# EAGLE design Smart_switch_edge_AI_V2 (EAGLE 9.6.2)
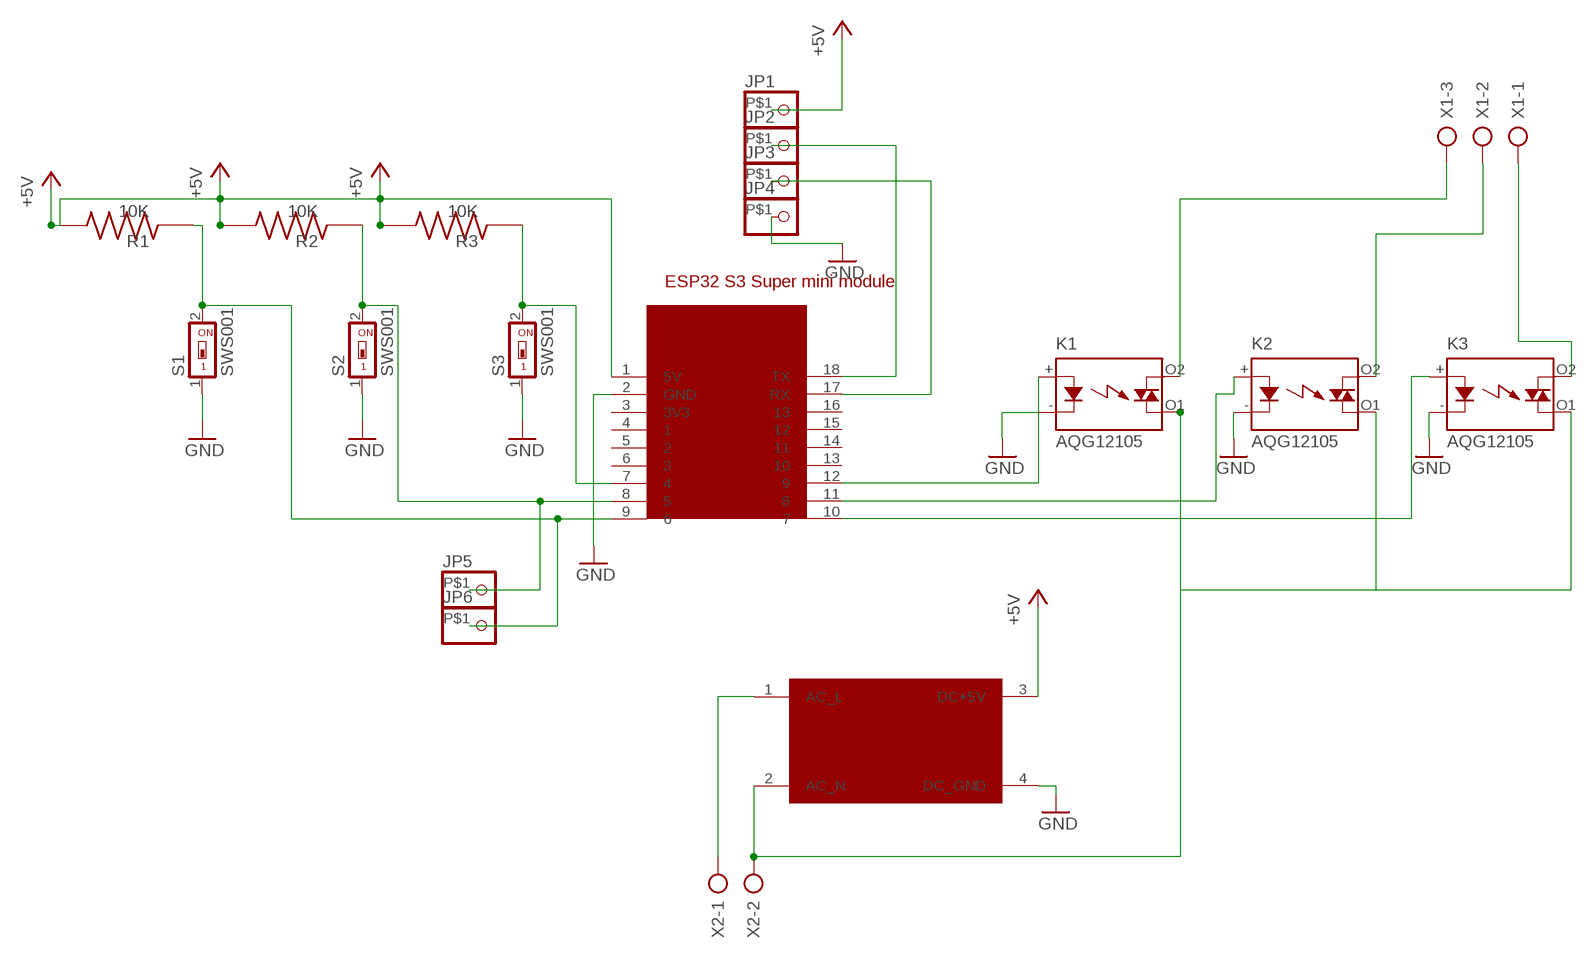
[diagram p0: schematic, sheet 1]

## Parts
JP1  PINHD-1X1-BIGPOGO  [1X1-BIGPOGO]
JP2  PINHD-1X1-BIGPOGO  [1X1-BIGPOGO]
JP3  PINHD-1X1-BIGPOGO  [1X1-BIGPOGO]
JP4  PINHD-1X1-BIGPOGO  [1X1-BIGPOGO]
JP5  PINHD-1X1-BIGPOGO  [1X1-BIGPOGO]
JP6  PINHD-1X1-BIGPOGO  [1X1-BIGPOGO]
K1  AQG12105  [AQG]
K2  AQG12105  [AQG]
K3  AQG12105  [AQG]
R1  10K  ERA6ARB512V  [RES_ERA6ARB512V]
R2  10K  ERA6ARB512V  [RES_ERA6ARB512V]
R3  10K  ERA6ARB512V  [RES_ERA6ARB512V]
S1  SWS001  [SMS-001]
S2  SWS001  [SMS-001]
S3  SWS001  [SMS-001]
U$1  ESP32_S3_SUPERMINI  [SON270P1795X2385X160-18N]
U$2  AL0505F  [DIP1650W60P600L1447H300Q4B]
X1  AK500/3  [AK500/3]
X2  AK500/2  [AK500/2]

## Nets
+5V: JP1.P$1 R1.2 R2.2 R3.2 U$1.1(5V) U$2.3(DC+5V)
GND: JP4.P$1 K1.-(K) K2.-(K) K3.-(K) S1.1 S2.1 S3.1 U$1.2(GND) U$2.4(DC_GND)
N$1: JP6.P$1 R1.1 S1.2 U$1.9
N$2: JP5.P$1 R2.1 S2.2 U$1.8
N$3: R3.1 S3.2 U$1.7
N$4: K1.+(A) U$1.12
N$5: K2.+(A) U$1.11
N$6: K3.+(A) U$1.10
N$7: K1.O2(DS1) X1.3
N$8: K2.O2(DS1) X1.2
N$9: K3.O2(DS1) X1.1
N$10: K1.O1(DS2) K2.O1(DS2) K3.O1(DS2) U$2.2(AC_N) X2.2
N$11: U$2.1(AC_L) X2.1
N$12: JP2.P$1 U$1.18(TX)
N$13: JP3.P$1 U$1.17(RX)
Unconnected: U$1.3(3V3) U$1.4 U$1.5 U$1.6 U$1.13 U$1.14 U$1.15 U$1.16

## Library data of the parts
JP1-JP6 = adafruit:PINHD-1X1: Pin header 1x1 for 0.1" spacing With round pins
K1-K3 = relay:AQG*: SOLID STATE RELAY NAiS Zero-cross, Non zero-cross Source: http://www.mew-europe.com/.. en_ds_61611_0000.pdf; MF: AROMAT/ MATSUSHITA; MPN: AQG12105; OC_FARNELL: unknown; OC_NEWARK: 20J4759
R1-R3 = ERA6ARB512V:ERA6ARB512V: Check availability <https://pricing.snapeda.com/parts/ERA-6ARB512V/Panasonic/view-part?ref=eda>; AVAILABILITY: In Stock; CHECK_PRICES: https://www.snapeda.com/parts/ERA-6ARB512V/Panasonic/view-part/?ref=eda; DESCRIPTION: RES 5.1K OHM 0.1% 1/8W 0805; MF: Panasonic; MP: ERA-6ARB512V; PACKAGE: 2012-2 Panasonic; PRICE: None; SNAPEDA_LINK: https://www.snapeda.com/parts/ERA-6ARB512V/Panasonic/view-part/?ref=snap
S1-S3 = smd-special:SWS001: SMD Dip Switch 1 pol.
U$1 = ESP32_S3_super_mini:ESP32_S3_SUPERMINI: ESP32_S3_supermini
U$2 = AL0505F:AL0505F: AL0505F AC to DC 5 volt 5W module
X1 = con-ptr500:AK500/3: CONNECTOR; OC_FARNELL: unknown; OC_NEWARK: unknown
X2 = con-ptr500:AK500/2: CONNECTOR; OC_FARNELL: unknown; OC_NEWARK: unknown

## Board
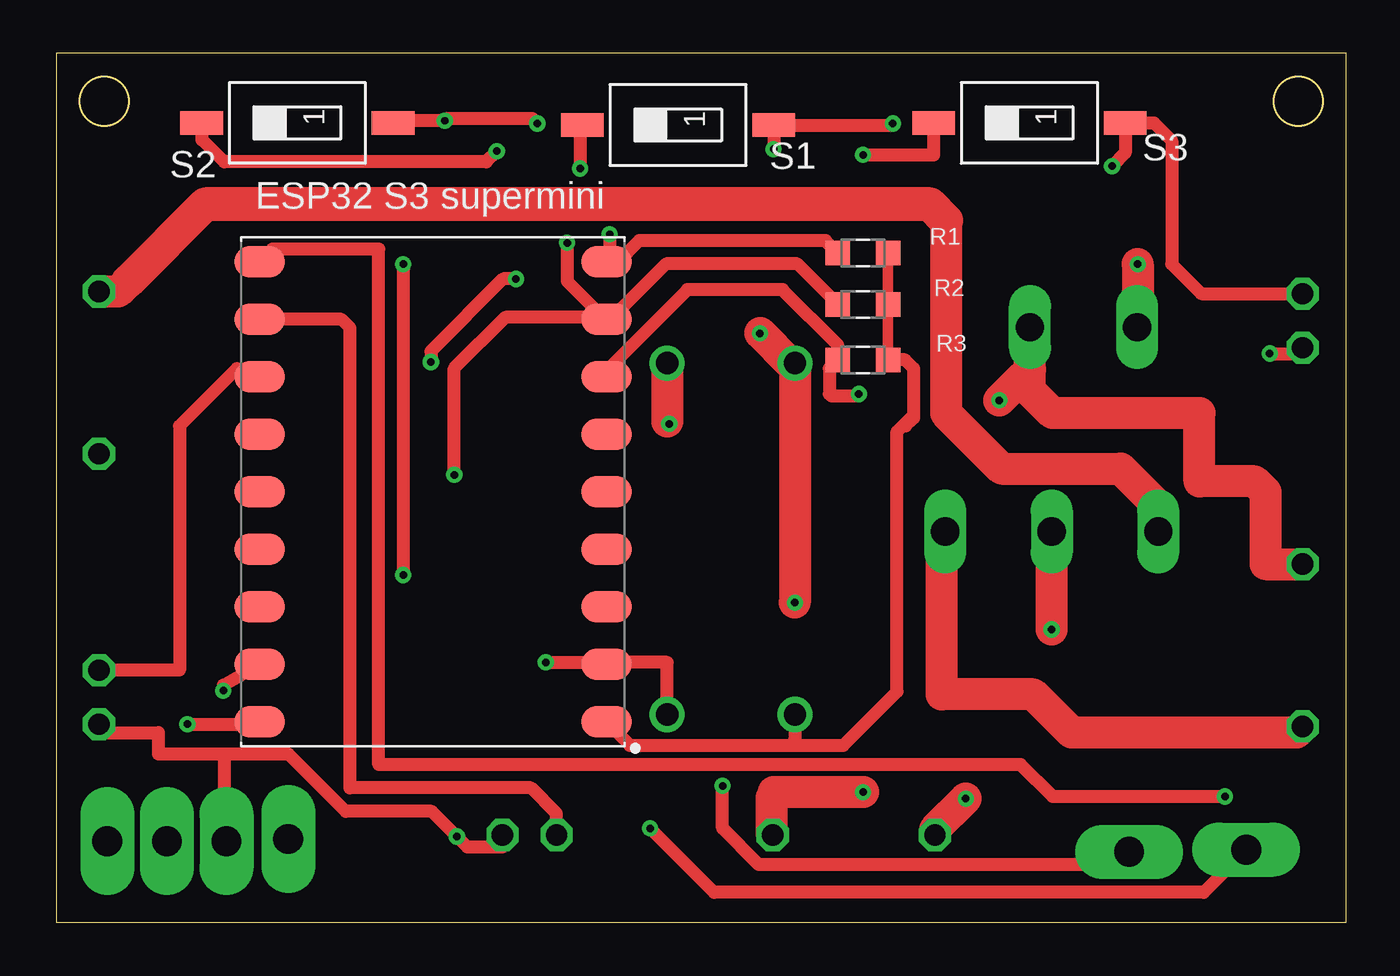
[diagram p1: board, top side]
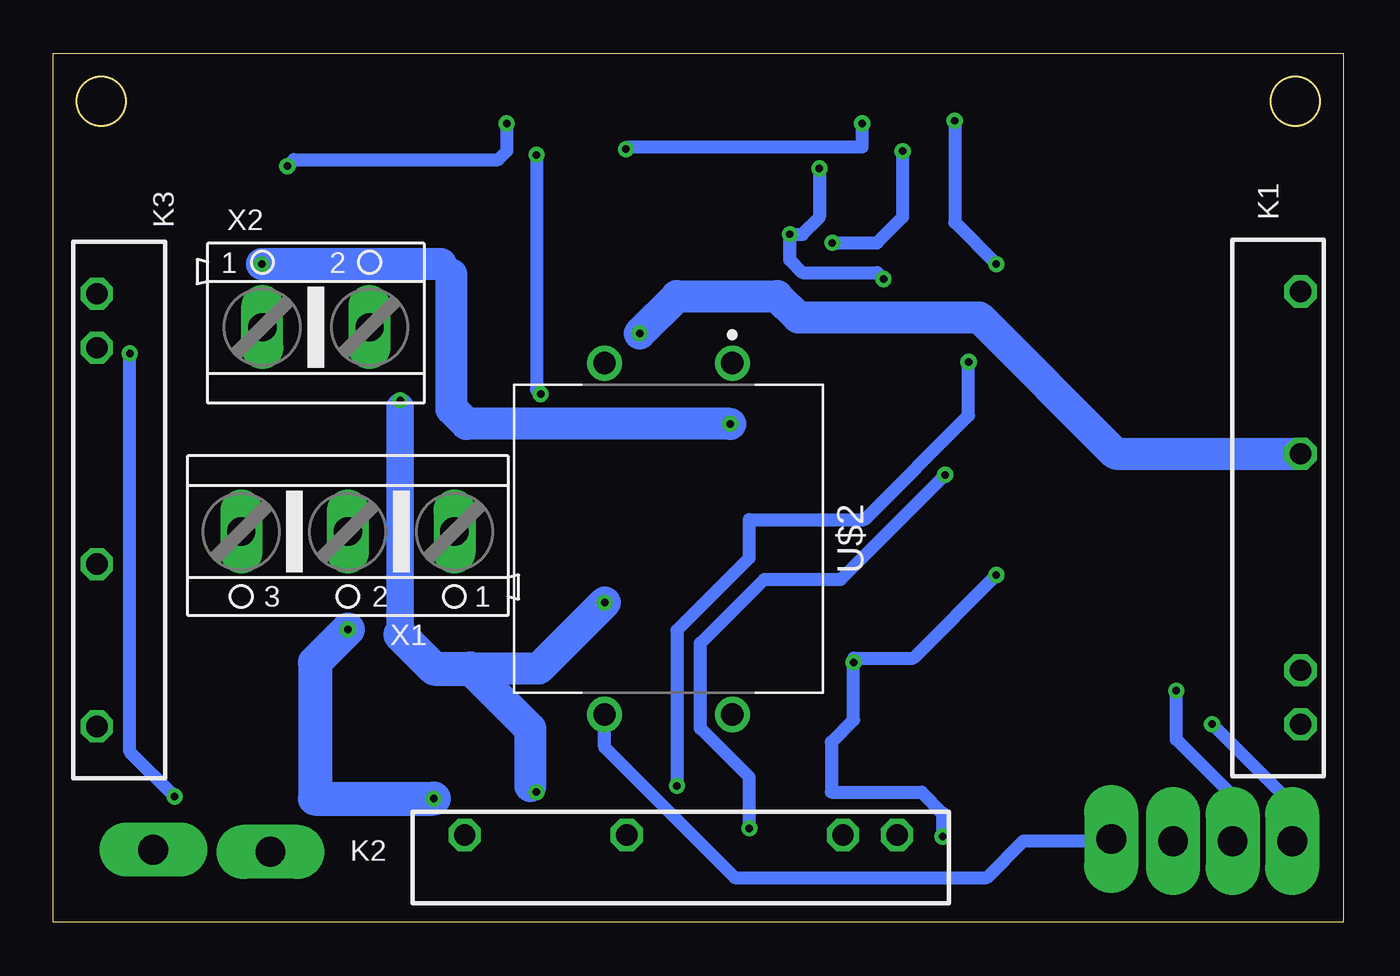
[diagram p2: board, bottom side, seen from below]

Size 60.6 x 40.8 mm. Coordinates in mm from the lower left corner, seen from the top.
Outline: 0,40.8 0,0 60.6,0 60.6,40.8 0,40.8
Outline: circle at 2.25,38.55 radius 1.15
Outline: circle at 58.35,38.55 radius 1.15
Copper layers (1*16): Top 0.035mm / dielectric 1.5mm / Bottom 0.035mm
Design rules "default *": minimum track width 6mil, minimum drill 0.35mm, track to track 6mil, track to pad 6mil, pad to pad 6mil, via to via 6mil, smd to smd 6mil, copper to edge 40mil, drill to drill 6mil, minimum pad ring 10mil, minimum via ring 8mil, stop-mask expansion 4mil, vias tented up to drill 0.64mm, thermal gap 10mil

### Footprints (pad centres in the part's own frame; a part is rotated, then mirrored left to right if it is on the bottom)
1X1-BIGPOGO = drill 1.4 pad 2.54 long: P$1 0,0
AQG = drill 1 octagon: + -7.62,0; - -10.16,0; O1 2.54,0; O2 10.16,0
RES_ERA6ARB512V = smd 1.15 x 1.15: 1 -1.175,0; 2 1.175,0
SMS-001 = smd 1.092 x 2.007: 1 0,-4.496; 2 0,4.496
SON270P1795X2385X160-18N = smd 2.36 x 1.47: 1 -8.145,10.8; 2 -8.145,8.1; 3 -8.145,5.4; 4 -8.145,2.7; 5 -8.145,0; 6 -8.145,-2.7; 7 -8.145,-5.4; 8 -8.145,-8.1; 9 -8.145,-10.8; 10 8.145,-10.8; 11 8.145,-8.1; 12 8.145,-5.4; 13 8.145,-2.7; 14 8.145,0; 15 8.145,2.7; 16 8.145,5.4; 17 8.145,8.1; 18 8.145,10.8
DIP1650W60P600L1447H300Q4B = drill 1.048 pad 1.649: 1 -8.25,3; 2 -8.25,-3; 3 8.25,-3; 4 8.25,3
AK500/3 = drill 1.321 long: 1 -5.004,0; 2 0,0; 3 5.004,0
AK500/2 = drill 1.321 long: 1 -2.515,0; 2 2.515,0

### Placement (x,y rotation side)
JP1  10.9,3.9 270 bottom
JP2  2.4,3.8 270 bottom
JP3  5.2,3.8 270 bottom
JP4  8,3.8 270 bottom
JP5  55.9,3.4 0 top
JP6  50.4,3.3 0 top
K1  2.01,19.45 90 bottom
K2  31.12,4.09 180 bottom
K3  58.55,19.35 270 bottom
R1  37.9,31.42 0 top
R2  37.9,29.01 0 top
R3  37.9,26.4 0 top
S1  29.21,37.43 90 top
S2  11.33,37.53 90 top
S3  45.72,37.53 90 top
U$1  17.7,20.2 180 top
U$2  31.7,18 270 bottom
X1  46.76,18.34 180 bottom
X2  48.26,27.94 0 bottom

### Tracks (layer width: path | path; a pad name or v marks a point on that pad's centre or on a via)
+5V
  Top 0.152: 34.7,8.6 35,8.3
  Top 0.5: R3.2 R2.2 R1.2
  Top 0.6: 40.27,23.8 40.27,26 39.87,26.4 R3.2 | 40.27,23.8 39.5,23.03 39.5,10.82 36.98,8.3 35,8.3 26.95,8.3 U$1.1 | 39.9,23.3 40.27,23.67 40.27,23.8 | U$2.3 34.7,8.6
  Bottom 0.152: 10.97,3.81 JP1.P$1
  Bottom 0.6: 10.97,3.81 15.02,3.81 16.75,2.09 28.58,2.09 34.7,8.21 U$2.3
GND  (via drill 0.35)
  Top 0.152: 25.95,12.2 U$1.2 25.76,12.19 25.6,12.2 | K1.- 2.4,8.9 | 7.92,3.81 JP4.P$1
  Top 0.5: U$1.2 25.64,12.1 25.32,12.42
  Top 0.6: v22.6,37.5 22.37,37.73 18.36,37.73 v18.26,37.63 15.93,37.63 S2.1 | v33.7,36.3 33.7,36.5 33.71,36.51 S1.1 39.23,37.43 v39.3,37.5 | v49.6,35.5 50.22,36.12 S3.1 51.57,37.53 52.4,36.7 52.4,30.9 53.79,29.51 K3.- | v23,12.2 25.6,12.2 | U$2.4 28.7,12.2 25.95,12.2 | v16.3,30.9 v16.3,16.3 | K2.- 20.96,3.52 19.32,3.52 v18.82,4.02 17.64,5.2 13.6,5.2 10.9,7.9 7.92,7.9 | 2.4,8.9 4.8,8.9 4.8,7.9 7.92,7.9 | 7.92,3.81 7.92,7.9
  Bottom 0.6: v33.7,36.3 33.6,36.4 22.6,36.4 v22.6,37.5 | v39.3,37.5 39.3,36.2 39.7,35.8 49.3,35.8 v49.6,35.5 | v18.82,4.02 18.82,5.12 19.8,6.1 24.05,6.1 24.05,8.45 23,9.5 v23,12.2 23,12.4 20.2,12.4 v16.3,16.3 | v18.26,37.63 18.26,32.86 v16.3,30.9
N$1  (via drill 0.35)
  Top 0.152: 26.84,31.46 26.39,31 U$1.9 26,31.16 26,31.3 | 24.61,35.41 v24.61,35.39
  Top 0.6: R1.1 36.14,32 27.39,32 26.84,31.46 26.59,31.21 | S1.2 24.61,37.33 24.61,35.41 | v26,32.3 26,31.3 | JP6.P$1 49.8,2.7 33,2.7 31.3,4.4 v31.3,6.4 | v21.6,30.2 21,30.2 17.6,26.8 v17.6,26.3
  Bottom 0.6: v24.61,35.39 24.61,33.09 25.4,32.3 v26,32.3 26,31.1 25.4,30.5 21.9,30.5 v21.6,30.2 | v31.3,6.4 31.3,13.7 27.9,17.1 27.9,18.9 22.5,18.9 17.6,23.8 v17.6,26.3
N$2  (via drill 0.35)
  Top 0.152: 25.93,28.22 U$1.8 25.76,28.35 25.58,28.52
  Top 0.5: 6.85,36.75 6.83,36.73
  Top 0.6: R2.1 34.82,30.91 28.66,30.91 26.05,28.3 U$1.8 | S2.2 6.83,36.73 | 6.85,36.75 7.9,35.7 20.2,35.7 v20.7,36.2 | v24,31.9 24,30.1 25.5,28.6 25.58,28.52 25.7,28.4 21.1,28.4 18.7,26 v18.7,21 | JP5.P$1 53.9,1.4 30.9,1.4 v27.9,4.4
  Bottom 0.6: v24,31.9 21.9,31.9 20.7,33.1 v20.7,36.2 | v27.9,4.4 27.9,6.8 30.2,9.1 30.2,13.1 27.2,16.1 23.6,16.1 v18.7,21
N$3  (via drill 0.35)
  Top 0.6: U$1.7 25.84,25.9 29.64,29.7 34.12,29.7 36.72,27.1 R3.1 36.32,26 36.32,24.8 36.42,24.7 37.7,24.7 v37.7,24.8 | S3.2 41.22,36.03 v37.9,36.03
  Bottom 0.6: v37.9,36.03 37.9,25 v37.7,24.8
N$4
  Top 0.152: 9.8,25.36 U$1.12
  Top 0.5: 8.5,26 9.8,26
  Top 0.6: 8.5,26 5.8,23.3 5.8,11.83 K1.+ | 9.8,26 9.8,25.36
N$5
  Top 0.6: U$1.11 13.4,28.3 13.8,27.9 13.8,6.3 22.3,6.3 23.5,5.1 K2.+
N$6  (via drill 0.35)
  Top 0.6: v54.9,5.9 46.8,5.9 45.3,7.4 15.15,7.4 15.15,31.6 10.15,31.6 U$1.10 | v57,26.7 58.28,26.7 K3.+
  Bottom 0.6: v54.9,5.9 57,8 v57,26.7
N$7
  Top 1.5: 3.4,30.1 2.91,29.61 K1.O2 | 41.8,32.96 41.8,23.9 44.4,21.3 50,21.3 51.76,19.54 X1.3
  Top 1.6: 3.4,30.1 7,33.7 41.06,33.7 41.8,32.96
N$8  (via drill 0.35)
  Top 1.5: v42.73,5.8 v41.28,4.35 | v46.76,13.74 X1.2
  Bottom 0.152: v41.28,4.35 K2.O2
  Bottom 1.6: v42.73,5.8 48.3,5.8 48.3,12.2 v46.76,13.74
N$9
  Top 0.152: 58.26,8.9 K3.O2 | 41.6,18.18 X1.1
  Top 1.5: 58.26,8.9 47.7,8.9 45.9,10.7 41.6,10.7 41.6,18.18
N$10  (via drill 0.35)
  Top 0.152: 33.7,5.95 33.6,5.85 | 33.08,27.68 v33.05,27.65 | 45.4,25.6 45.74,25.95
  Top 0.6: U$2.2 34.5,26.25
  Top 1.5: U$2.2 v34.7,15 | K3.O1 56.8,16.81 56.8,20.2 56.3,20.7 53.7,20.7 53.7,23.9 46.8,23.9 45.74,24.95 X2.2 45.74,25.95 | v37.9,6.1 33.7,6.1 33.7,5.95 | K2.O1 33.6,4.15 33.6,5.85 | 34.5,26.25 33.08,27.68 | v44.3,24.5 45.4,25.6
  Bottom 0.152: 38.2,6.4 v37.9,6.1 | 44.3,24.2 v44.3,24.5
  Bottom 1.3: 44.3,13.5 44.3,24.2
  Bottom 1.5: v34.7,15 37.8,11.9 41.01,11.9 38.2,9.09 38.2,6.4 | v33.05,27.65 31.3,29.4 26.6,29.4 25.6,28.4 17.1,28.4 10.7,22 K1.O1
  Bottom 1.6: 41.01,11.9 42.7,11.9 44.3,13.5
N$11  (via drill 0.35)
  Top 0.152: 28.7,23.5 v28.8,23.4 | 50.8,27.96 X2.1
  Top 1.5: U$2.1 28.7,23.5 | v50.8,30.9 50.8,27.96
  Bottom 0.152: 41.9,30.41 42.39,30.9
  Bottom 1.5: 41.9,30.41 41.9,24.11 41.19,23.4 v28.8,23.4 | 42.39,30.9 v50.8,30.9
N$12  (via drill 0.35)
  Top 0.152: 9.45,9.3 U$1.18
  Top 0.6: v6.16,9.3 9.45,9.3
  Bottom 0.152: 2.44,3.81 JP2.P$1
  Bottom 0.6: v6.16,9.3 2.44,5.57 2.44,3.81
N$13  (via drill 0.35)
  Top 0.152: v7.85,10.87 7.85,11.13
  Top 0.6: 7.85,11.13 U$1.17
  Bottom 0.6: v7.85,10.87 7.85,8.59 5.33,6.07 5.33,3.81 JP3.P$1